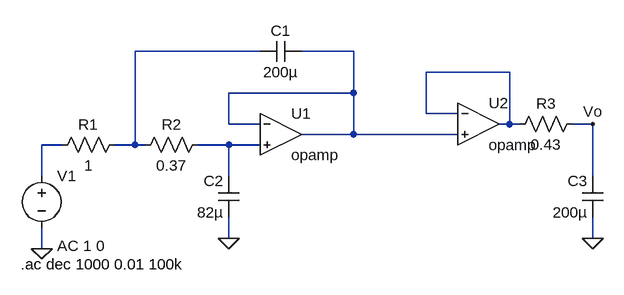
[diagram p0: schematic TS4.asc]
TS4.asc, the LTspice schematic file:
Version 4
SHEET 1 880 680
WIRE 96 32 -96 32
WIRE 240 32 160 32
WIRE 480 64 352 64
WIRE 240 96 240 32
WIRE 240 96 48 96
WIRE 352 128 352 64
WIRE 400 128 352 128
WIRE 48 144 48 96
WIRE 96 144 48 144
WIRE 480 144 480 64
WIRE 480 144 464 144
WIRE 496 144 480 144
WIRE 608 144 576 144
WIRE 240 160 240 96
WIRE 240 160 160 160
WIRE 400 160 240 160
WIRE -208 176 -240 176
WIRE -96 176 -96 32
WIRE -96 176 -128 176
WIRE -80 176 -96 176
WIRE 48 176 0 176
WIRE 96 176 48 176
WIRE -240 224 -240 176
WIRE 48 224 48 176
WIRE 608 224 608 144
WIRE 48 320 48 288
WIRE 608 320 608 288
WIRE -240 336 -240 304
FLAG 48 320 0
FLAG 608 320 0
FLAG -240 336 0
FLAG 608 144 Vo
SYMBOL opamp 128 96 R0
SYMATTR InstName U1
SYMBOL opamp 432 80 R0
SYMATTR InstName U2
SYMBOL res -112 160 R90
WINDOW 0 0 56 VBottom 2
WINDOW 3 32 56 VTop 2
SYMATTR InstName R1
SYMATTR Value 1
SYMBOL res 16 160 R90
WINDOW 0 0 56 VBottom 2
WINDOW 3 32 56 VTop 2
SYMATTR InstName R2
SYMATTR Value 0.37
SYMBOL res 592 128 R90
WINDOW 0 0 56 VBottom 2
WINDOW 3 32 56 VTop 2
SYMATTR InstName R3
SYMATTR Value 0.43
SYMBOL cap 160 16 R90
WINDOW 0 0 32 VBottom 2
WINDOW 3 32 32 VTop 2
SYMATTR InstName C1
SYMATTR Value 200µ
SYMBOL cap 64 288 R180
WINDOW 0 24 56 Left 2
WINDOW 3 24 8 Left 2
SYMATTR InstName C2
SYMATTR Value 82µ
SYMBOL cap 624 288 R180
WINDOW 0 24 56 Left 2
WINDOW 3 24 8 Left 2
SYMATTR InstName C3
SYMATTR Value 200µ
SYMBOL voltage -240 208 R0
WINDOW 123 24 124 Left 2
WINDOW 39 0 0 Left 0
SYMATTR Value2 AC 1 0
SYMATTR InstName V1
SYMATTR Value ""
TEXT -272 360 Left 2 !.ac dec 1000 0.01 100k

The netlist it stands for:
* TS4.asc
XU1 N002 N005 N002 opamp Aol=100K GBW=10Meg  ; pins invin noninvin out
XU2 N003 N002 N003 opamp Aol=100K GBW=10Meg  ; pins invin noninvin out
R1 N001 N004 1
R2 N005 N001 0.37
R3 Vo N003 0.43
C1 N002 N001 200µ
C2 0 N005 82µ
C3 0 Vo 200µ
V1 N004 0 AC 1 0
.ac dec 1000 0.01 100k
.backanno
.end